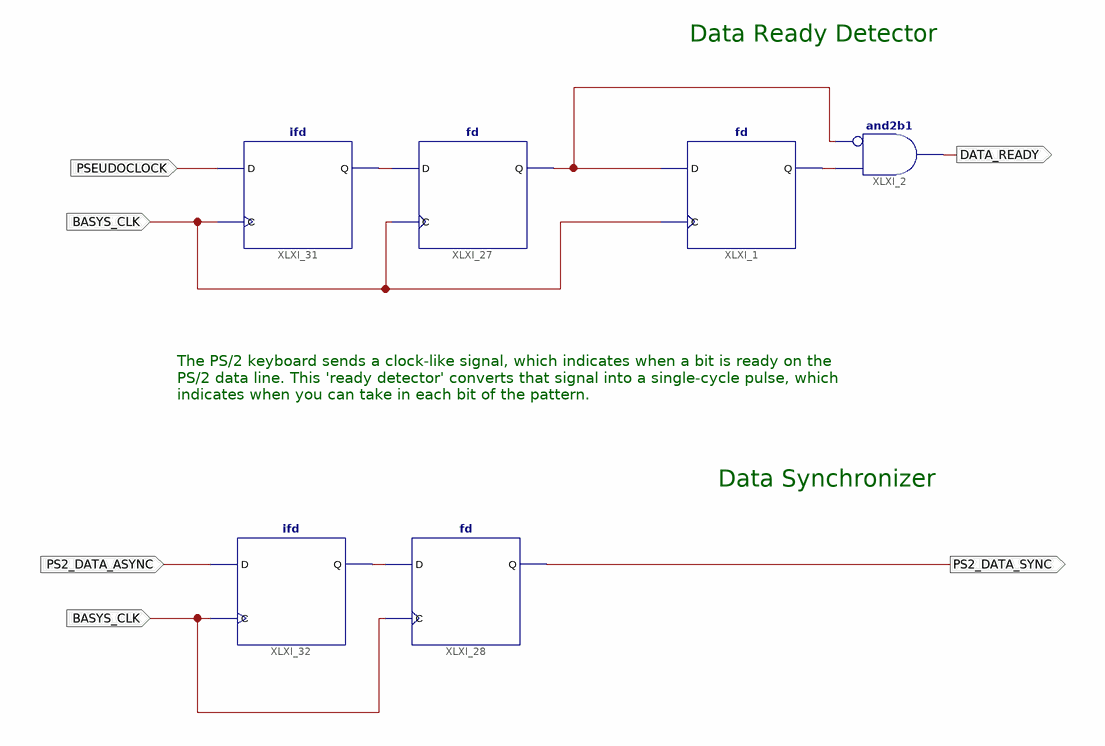
[diagram p0: schematic sheet 1]
// Xilinx ISE schematic KeyboardSync1.sch (spartan3e) as structural Verilog: 6 symbols, 5 ports
module KeyboardSync1 (
  input  PSEUDOCLOCK,
  input  BASYS_CLK,
  input  PS2_DATA_ASYNC,
  output DATA_READY,
  output PS2_DATA_SYNC
);

  wire XLXN_3, XLXN_4, XLXN_9, XLXN_HID;

  fd XLXI_1 (.C(BASYS_CLK), .D(XLXN_3), .Q(XLXN_4));
  and XLXI_2 (DATA_READY, ~XLXN_3, XLXN_4);  // and2b1
  fd XLXI_27 (.C(BASYS_CLK), .D(XLXN_HID), .Q(XLXN_3));
  fd XLXI_28 (.C(BASYS_CLK), .D(XLXN_9), .Q(PS2_DATA_SYNC));
  ifd XLXI_31 (.C(BASYS_CLK), .D(PSEUDOCLOCK), .Q(XLXN_HID));
  ifd XLXI_32 (.C(BASYS_CLK), .D(PS2_DATA_ASYNC), .Q(XLXN_9));

  // Notes on the sheet:
  //   Data Ready Detector
  //   The PS/2 keyboard sends a clock-like signal, which indicates when a bit is ready on the
  //   PS/2 data line. This 'ready detector' converts that signal into a single-cycle pulse, which
  //   indicates when you can take in each bit of the pattern.
  //   Data Synchronizer
  //   LOC on signal PSEUDOCLOCK = P11
  //   LOC on signal BASYS_CLK = P89
  //   LOC on signal PS2_DATA_ASYNC = P10
endmodule
